# Altium schematic sheet bspd.SchDoc
size A4; SheetNumber: 1; SheetTotal: 2
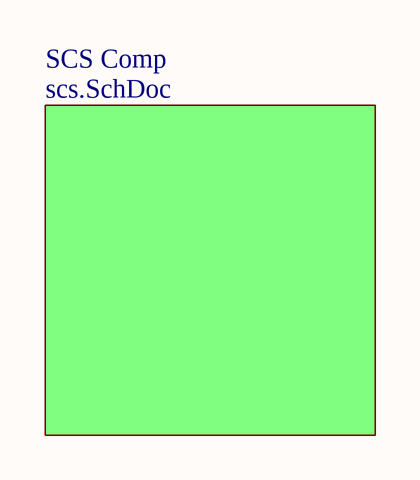
[diagram p0: bspd.SchDoc]

## Sub-sheets
SCS Comp = scs.SchDoc: no entries